# EAGLE schematic rj45-adaptor-1-2 (EAGLE 8.4.3)
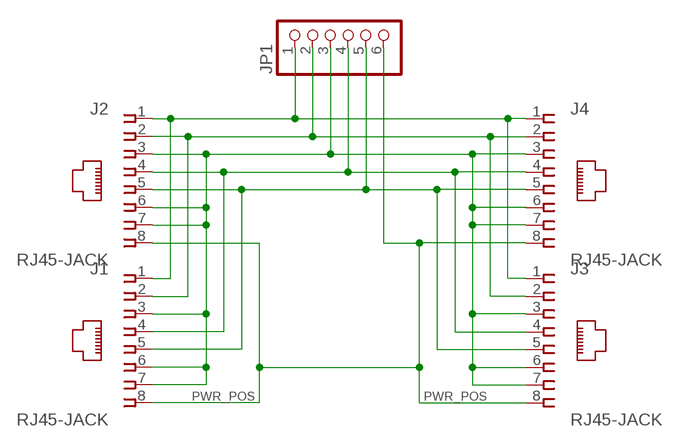
[diagram p0: schematic, sheet 1]

## Parts
J1  RJ45-JACK  RJ45-JACKRJ45-PULSE-E5J00  [RJ45-PULSE-E5J88]
J2  RJ45-JACK  RJ45-JACKRJ45-PULSE-E5J00  [RJ45-PULSE-E5J88]
J3  RJ45-JACK  RJ45-JACKRJ45-PULSE-E5J00  [RJ45-PULSE-E5J88]
J4  RJ45-JACK  RJ45-JACKRJ45-PULSE-E5J00  [RJ45-PULSE-E5J88]
JP1  PINHD-1X6  [1X06]

## Nets
ALT1: J1.4 J2.4 J3.4 J4.4 JP1.4
ALT2: J1.5 J2.5 J3.5 J4.5 JP1.5
CANH: J1.1 J2.1 J3.1 J4.1 JP1.1
CANL: J1.2 J2.2 J3.2 J4.2 JP1.2
GND: J1.3 J1.6 J1.7 J2.3 J2.6 J2.7 J3.3 J3.6 J3.7 J4.3 J4.6 J4.7 JP1.3
PWR_POS: J1.8 J2.8 J3.8 J4.8 JP1.6

## Library data of the parts
J1-J4 = trainlib:RJ45-JACK: Mod. Jack, Right Angle, 8 posiotion, 8 contatcs RJ45 Source: GLX-S-88M.pdf
JP1 = pinhead:PINHD-1X6: PIN HEADER